# EAGLE design buttons (EAGLE 7.7.0)

## Sheet 1 of 2
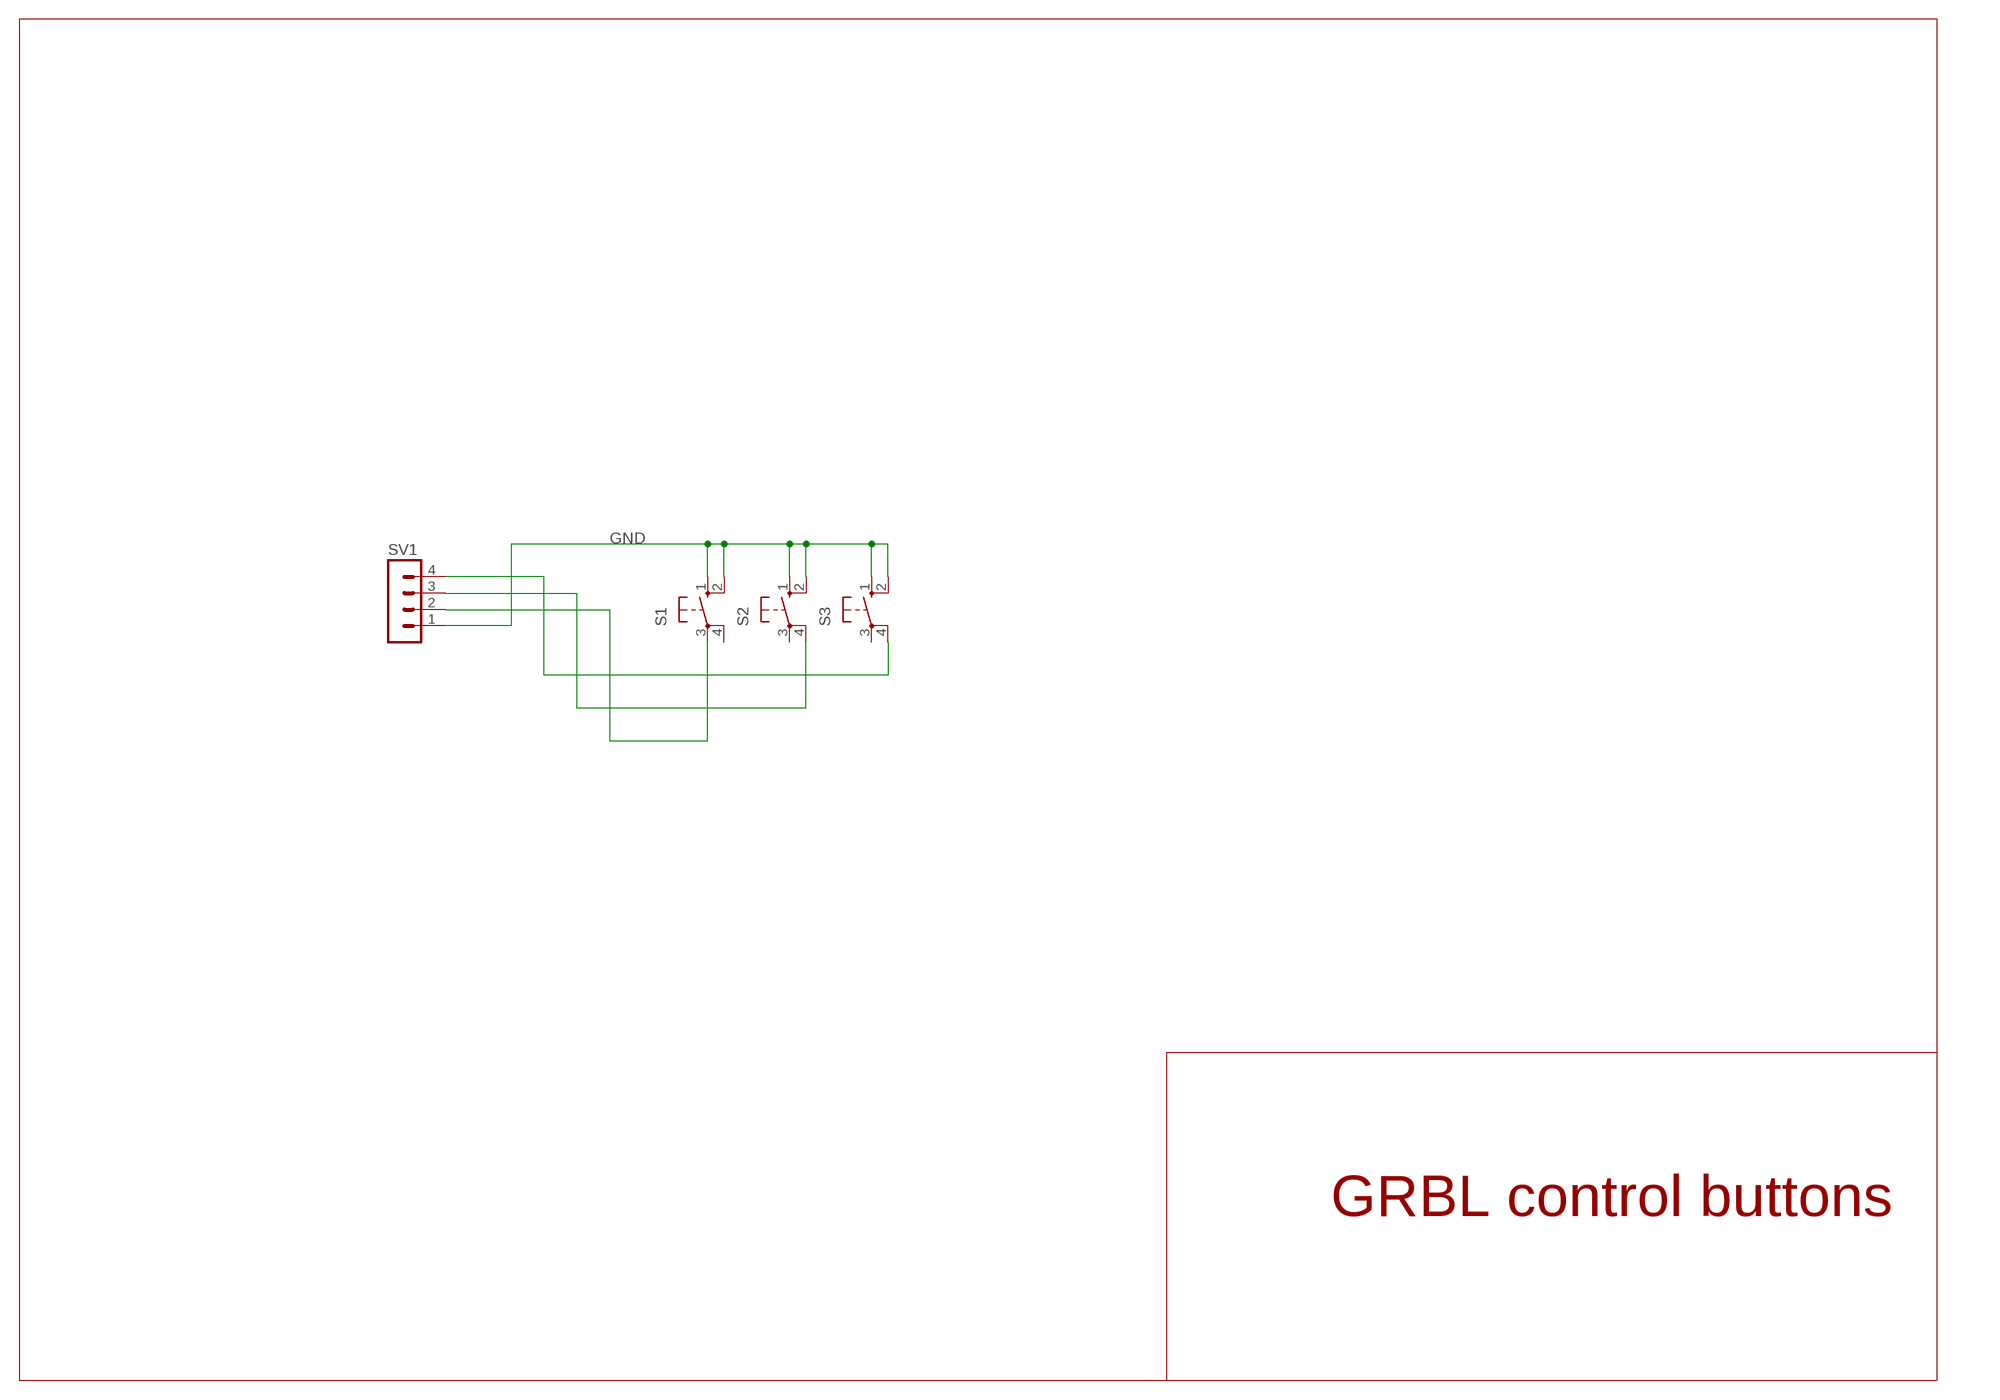
[diagram p0: schematic, sheet 1]

### Parts
S1  40-XX  [B3F-40XX]
S2  40-XX  [B3F-40XX]
S3  40-XX  [B3F-40XX]
SV1  MA04-1  [MA04-1]

### Nets
GND: S1.1(S) S1.2(S1) S2.1(S) S2.2(S1) S3.1(S) S3.2(S1) SV1.1
N$2: S3.4(P1) SV1.4
N$3: S2.4(P1) SV1.3
N$4: S1.3(P) SV1.2
Unconnected: S1.4(P1) S2.3(P) S3.3(P)

### Notes on the sheet
- GRBL control buttons

## Sheet 2 of 2
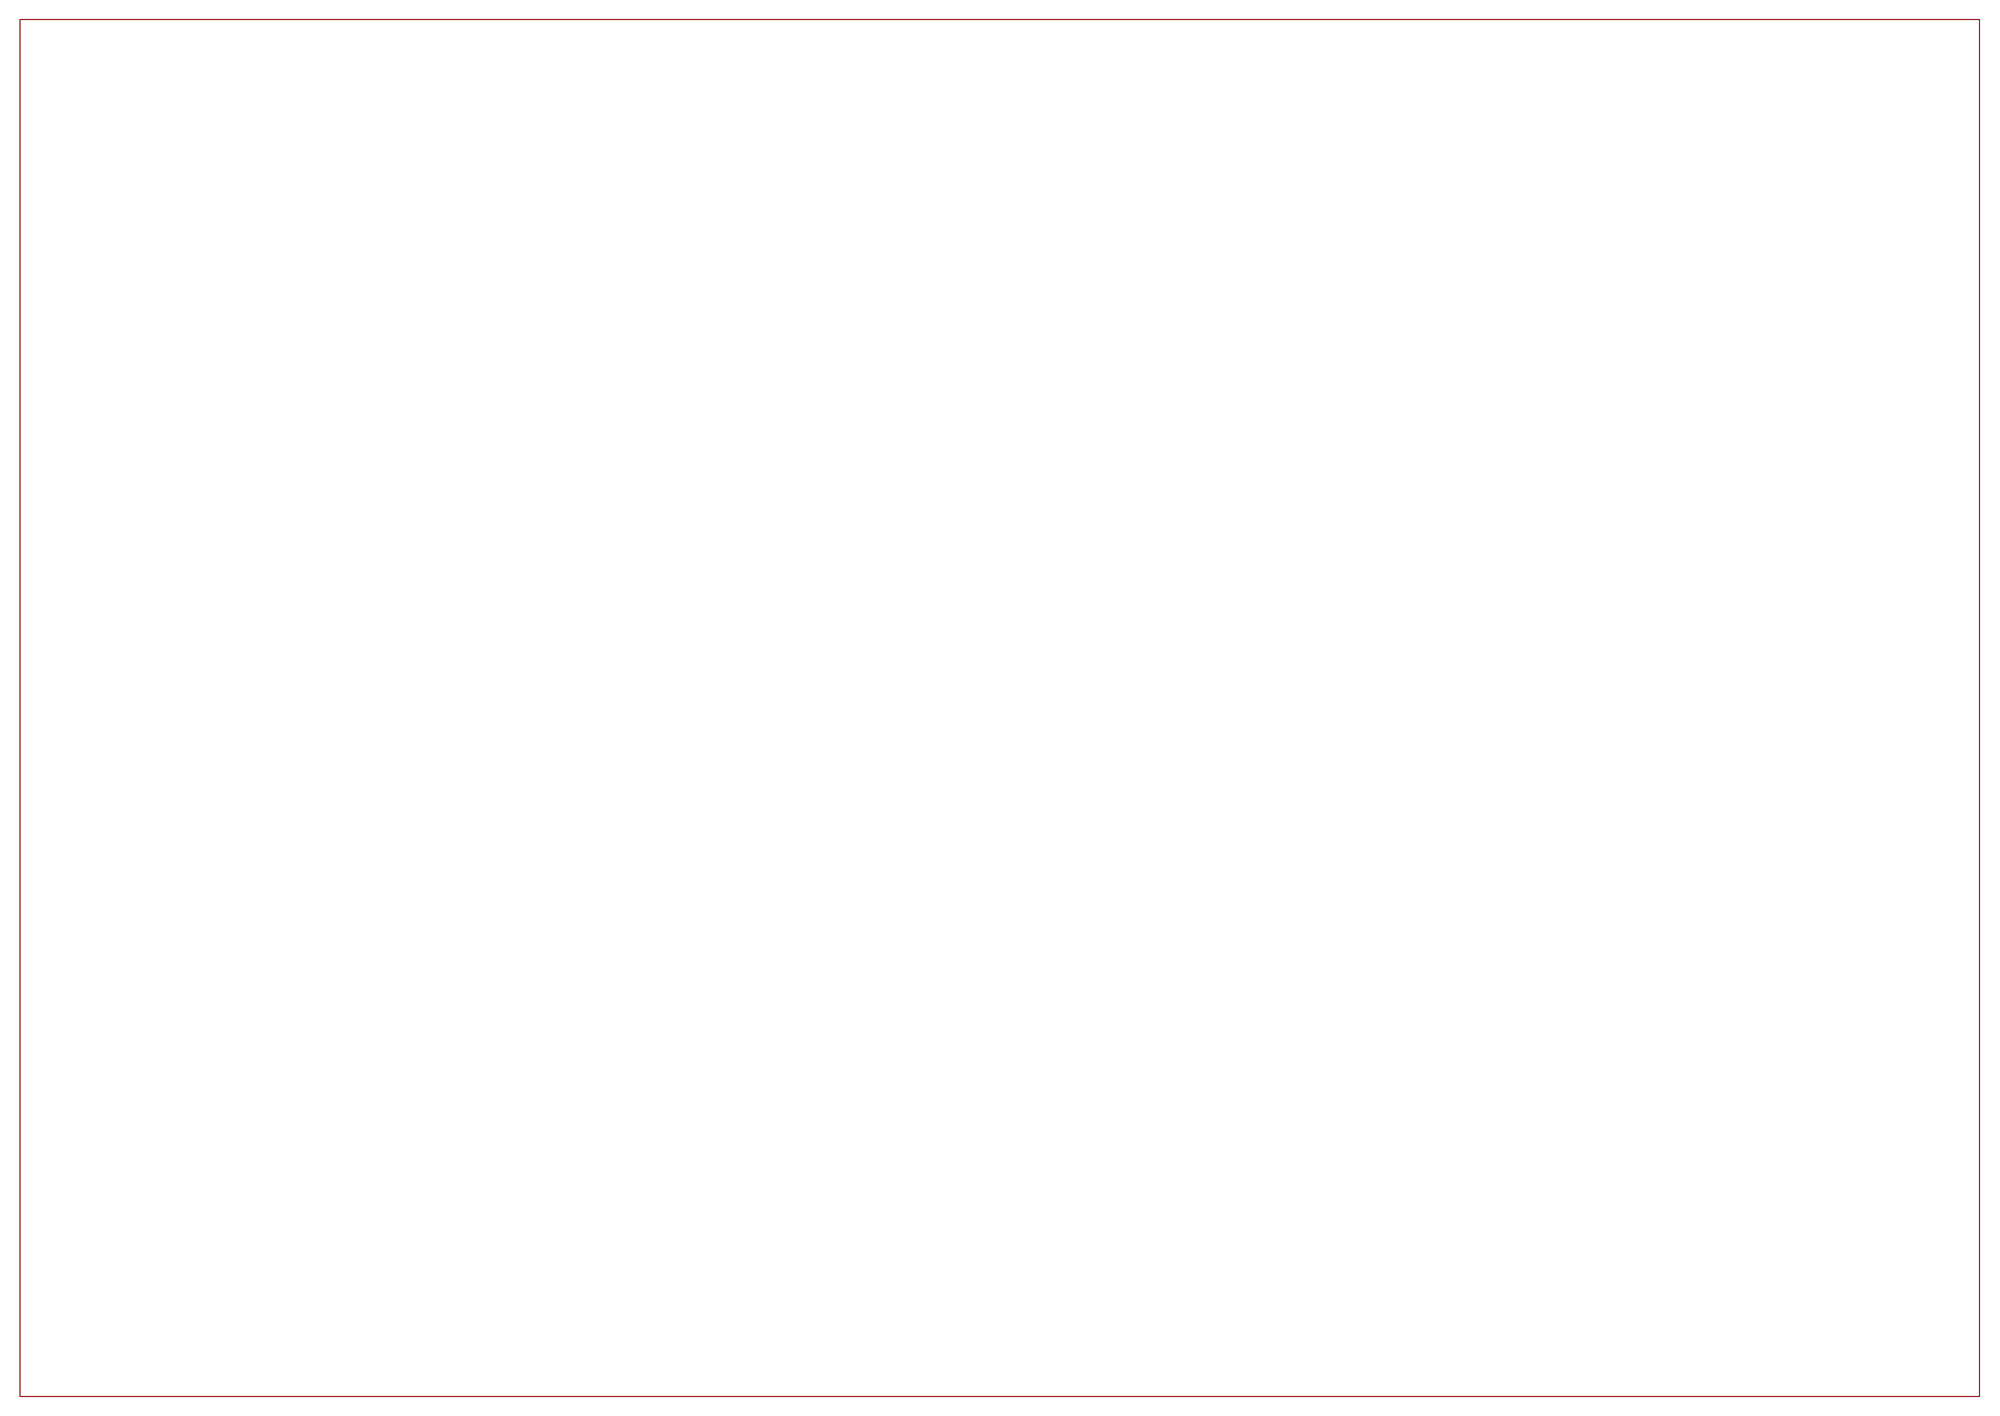
[diagram p1: schematic, sheet 2]

## Library data of the parts
S1-S3 = switch-omron:40-XX: OMRON SWITCH; MF: OMRON COMPONENTS USA; MPN: B3F-4000; OC_FARNELL: 176434; OC_NEWARK: 36K3105
SV1 = con-lstb:MA04-1: PIN HEADER; OC_FARNELL: unknown; OC_NEWARK: unknown

## Board
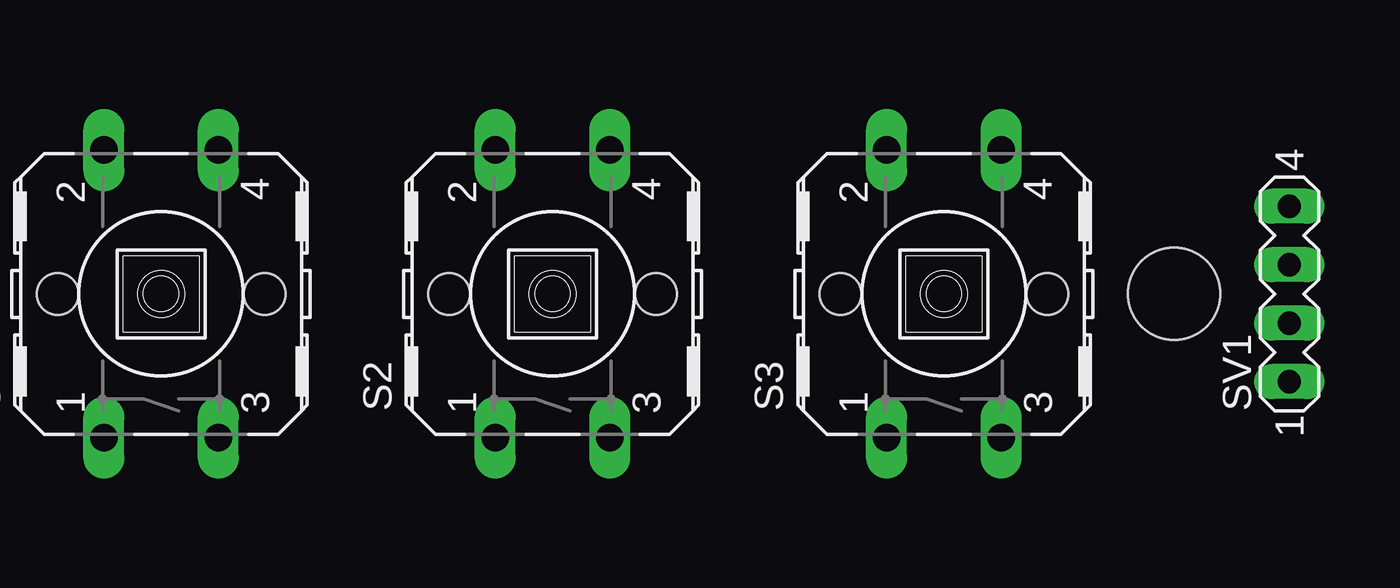
[diagram p2: board, top side]
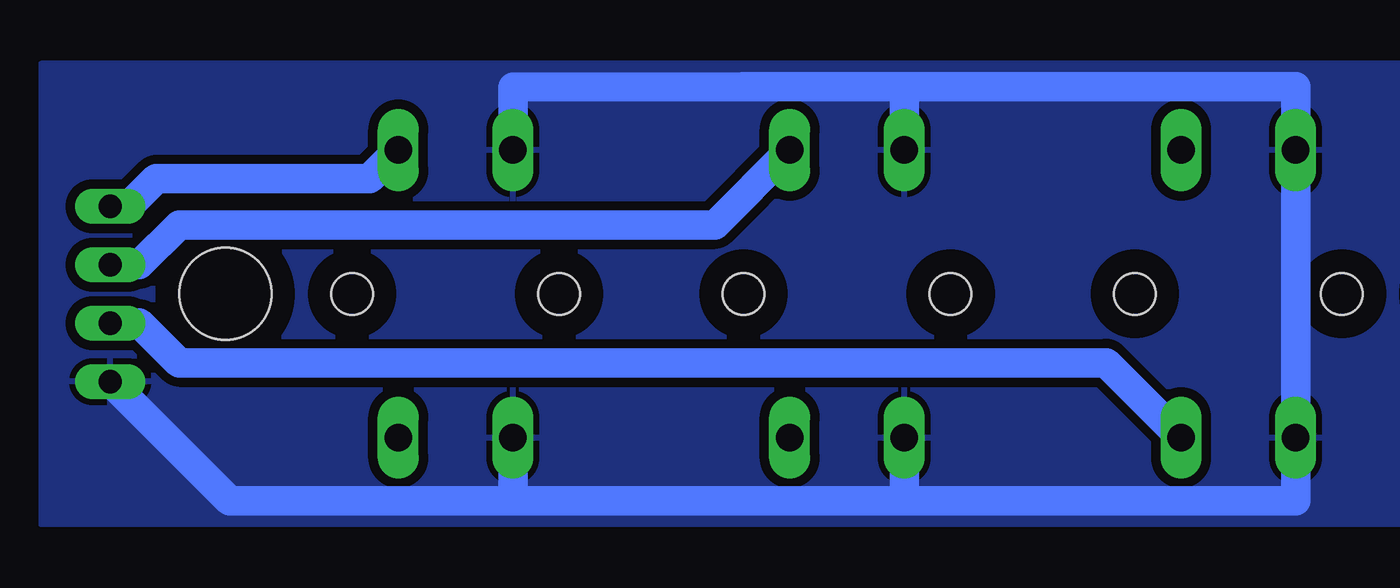
[diagram p3: board, bottom side, seen from below]

No outline drawn. Coordinates in mm, seen from the top.
Copper layers (1*16): Top 0.035mm / dielectric 1.5mm / Bottom 0.035mm
Design rules "default": minimum track width 10mil, minimum drill 24mil, track to track 8mil, track to pad 8mil, pad to pad 8mil, via to via 8mil, smd to smd 8mil, copper to edge 40mil, drill to drill 8mil, minimum pad ring 10mil, minimum via ring 8mil, stop-mask expansion 4mil, vias tented up to drill 0mil, thermal gap 10mil
Holes 4 mm at 4,10 58,10
tKeepout: area 0.2,6.2 to 7.8,13.8; area 54.2,6.2 to 61.8,13.8

### Footprints (pad centres in the part's own frame; a part is rotated, then mirrored left to right if it is on the bottom)
B3F-40XX = drill 1.194 long: 1 -6.248,2.489; 2 6.248,2.489; 3 -6.248,-2.489; 4 6.248,-2.489 | hole 1.803: 0,-4.496; 0,4.496
MA04-1 = drill 1.016 long: 1 -3.81,0; 2 -1.27,0; 3 1.27,0; 4 3.81,0

### Placement (x,y rotation side)
S1  14,10 90 top
S2  31,10 90 top
S3  48,10 90 top
SV1  63,10 90 top

### Tracks (layer width: path | path; a pad name or v marks a point on that pad's centre or on a via)
GND
  Bottom 1.27: 35.5,1 57.81,1 SV1.1 | S2.1 28.51,1.01 23.5,1 | 23.5,1 11.5,1 S1.1 S1.2 11.51,18.99 11.5,19 28.5,19 | S3.1 45.51,1.01 35.5,1 | 35.5,1 23.5,1 | 28.5,19 28.5,17.26 S2.2 | S3.2 45.51,18.99 35.5,19 28.5,19
  pour Bottom (isolate 0.406): 0,0 0,20 66,20 66,0
N$2
  Bottom 1.27: SV1.4 62.19,13.81 61,15 51.74,15 S3.4
N$3
  Bottom 1.27: SV1.3 61.73,11.27 60,13 36.74,13 S2.4
N$4
  Bottom 1.27: SV1.2 61.73,8.73 60,7 19.74,7 S1.3